# Altium schematic sheet vonalszenzorok.SchDoc
size A4
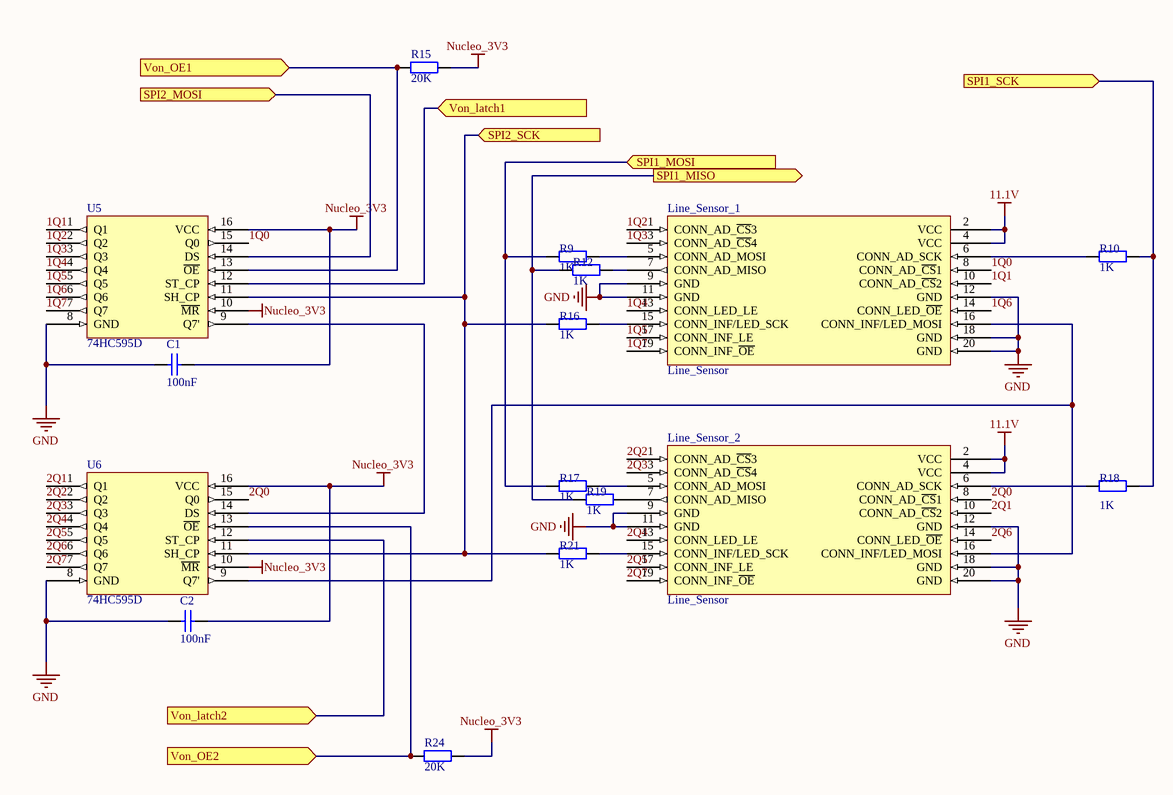
[diagram p0: vonalszenzorok.SchDoc]

## Parts
C1  100nF  [FP_0402_CAP_050]
C2  100nF  [FP_0402_CAP_050]
Line_Sensor_1  Line_Sensor  [CONNECTOR-20P]
Line_Sensor_2  Line_Sensor  [CONNECTOR-20P]
R9  1K  [FP_0603_RES]
R10  1K  [FP_0603_RES]
R12  1K  [FP_0603_RES]
R15  20K  [FP_0603_RES]
R16  1K  [FP_0603_RES]
R17  1K  [FP_0603_RES]
R18  1K  [FP_0603_RES]
R19  1K  [FP_0603_RES]
R21  1K  [FP_0603_RES]
R24  20K  [FP_0603_RES]
U5  74HC595D  [SO16 (Pl.:Shift-registerhez)]
U6  74HC595D  [SO16 (Pl.:Shift-registerhez)]

## Ports
SPI1_MISO (out), SPI1_MOSI (in), SPI1_SCK (in), SPI2_MOSI (in), SPI2_SCK (in), Von_latch1 (in), Von_latch2 (in), Von_OE1 (in), Von_OE2 (in)

## Nets
11.1V: Line_Sensor_1.2(VCC) Line_Sensor_1.4(VCC) Line_Sensor_2.2(VCC) Line_Sensor_2.4(VCC)
GND: C1.1 C2.1 Line_Sensor_1.9(GND) Line_Sensor_1.11(GND) Line_Sensor_1.12(GND) Line_Sensor_1.18(GND) Line_Sensor_1.20(GND) Line_Sensor_2.9(GND) Line_Sensor_2.11(GND) Line_Sensor_2.12(GND) Line_Sensor_2.18(GND) Line_Sensor_2.20(GND) U5.8(GND) U6.8(GND)
Nucleo_3V3: C1.2 C2.2 R15.2 R24.2 U5.10(~{MR}) U5.16(VCC) U6.10(~{MR}) U6.16(VCC)
1Q0: Line_Sensor_1.8(CONN_AD_~{CS}1) U5.15(Q0)
1Q1: Line_Sensor_1.10(CONN_AD_~{CS}2) U5.1(Q1)
1Q2: Line_Sensor_1.1(CONN_AD_~{CS}3) U5.2(Q2)
1Q3: Line_Sensor_1.3(CONN_AD_~{CS}4) U5.3(Q3)
1Q4: Line_Sensor_1.13(CONN_LED_LE) U5.4(Q4)
1Q5: Line_Sensor_1.17(CONN_INF_LE) U5.5(Q5)
1Q6: Line_Sensor_1.14(CONN_LED_~{OE}) U5.6(Q6)
1Q7: Line_Sensor_1.19(CONN_INF_~{OE}) U5.7(Q7)
2Q0: Line_Sensor_2.8(CONN_AD_~{CS}1) U6.15(Q0)
2Q1: Line_Sensor_2.10(CONN_AD_~{CS}2) U6.1(Q1)
2Q2: Line_Sensor_2.1(CONN_AD_~{CS}3) U6.2(Q2)
2Q3: Line_Sensor_2.3(CONN_AD_~{CS}4) U6.3(Q3)
2Q4: Line_Sensor_2.13(CONN_LED_LE) U6.4(Q4)
2Q5: Line_Sensor_2.17(CONN_INF_LE) U6.5(Q5)
2Q6: Line_Sensor_2.14(CONN_LED_~{OE}) U6.6(Q6)
2Q7: Line_Sensor_2.19(CONN_INF_~{OE}) U6.7(Q7)
SPI1_MISO: R12.1 R19.1 ; port SPI1_MISO
SPI1_MOSI: R9.1 R17.1 ; port SPI1_MOSI
SPI1_SCK: R10.2 R18.2 ; port SPI1_SCK
SPI2_MOSI: U5.14(DS) ; port SPI2_MOSI
SPI2_SCK: R16.1 R21.1 U5.11(SH_CP) U6.11(SH_CP) ; port SPI2_SCK
Von_latch1: U5.12(ST_CP) ; port Von_latch1
Von_latch2: U6.12(ST_CP) ; port Von_latch2
Von_OE1: R15.1 U5.13(~{OE}) ; port Von_OE1
Von_OE2: R24.1 U6.13(~{OE}) ; port Von_OE2
NetLine_Sensor_1_5: Line_Sensor_1.5(CONN_AD_MOSI) R9.2
NetLine_Sensor_1_6: Line_Sensor_1.6(CONN_AD_SCK) R10.1
NetLine_Sensor_1_7: Line_Sensor_1.7(CONN_AD_MISO) R12.2
NetLine_Sensor_1_15: Line_Sensor_1.15(CONN_INF/LED_SCK) R16.2
NetLine_Sensor_1_16: Line_Sensor_1.16(CONN_INF/LED_MOSI) Line_Sensor_2.16(CONN_INF/LED_MOSI) U6.9(Q7')
NetLine_Sensor_2_5: Line_Sensor_2.5(CONN_AD_MOSI) R17.2
NetLine_Sensor_2_6: Line_Sensor_2.6(CONN_AD_SCK) R18.1
NetLine_Sensor_2_7: Line_Sensor_2.7(CONN_AD_MISO) R19.2
NetLine_Sensor_2_15: Line_Sensor_2.15(CONN_INF/LED_SCK) R21.2
NetU5_9: U5.9(Q7') U6.14(DS)

## Library data of the parts
C1 C2 = CAP: Capacitor; Value: 100nF
Line_Sensor_1 Line_Sensor_2 = Line_Sensor: AUT
R9 R10 R12 R15-R19 R21 R24 = RES: Resistor
  R9 R10 R12 R16-R19 R21: Value: 1K
  R15 R24: Value: 20K
U5 U6 = 74HC595D: Vonalszenzorhoz; Supplier: Lomex; Reference: 87-01-20